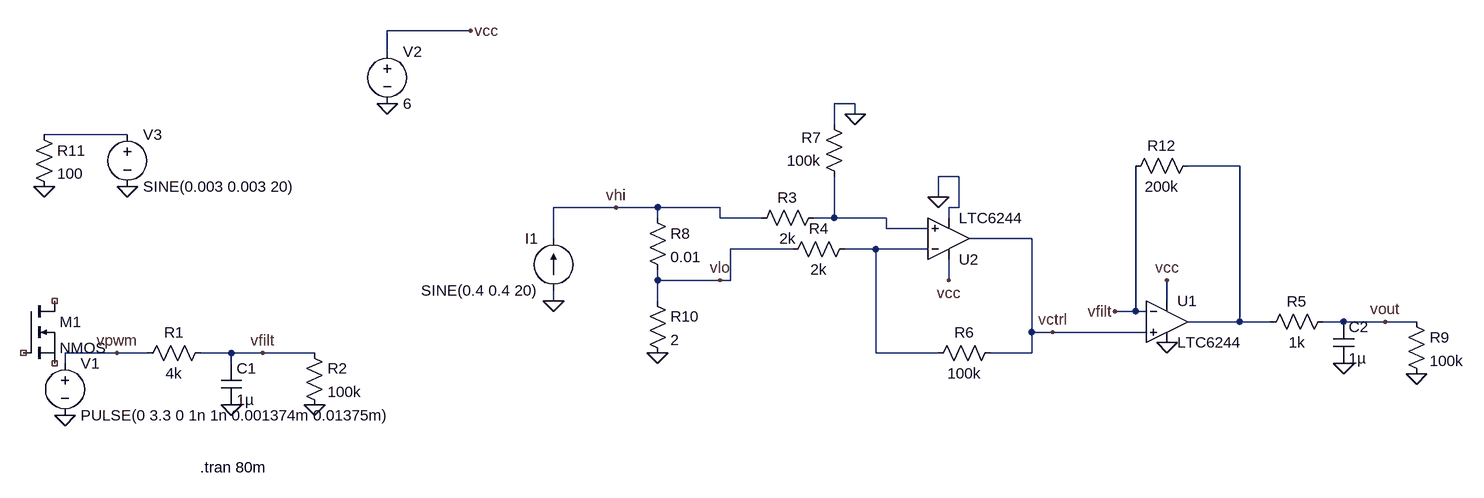
[diagram p0: schematic dchrg_ilim.asc]
dchrg_ilim.asc, the LTspice schematic file:
Version 4
SHEET 1 2260 680
WIRE 720 -368 592 -368
WIRE 592 -336 592 -368
WIRE 1312 -256 1280 -256
WIRE 1312 -240 1312 -256
WIRE 1280 -224 1280 -256
WIRE 192 -208 64 -208
WIRE 1904 -160 1824 -160
WIRE 1472 -144 1440 -144
WIRE 1440 -112 1440 -144
WIRE 944 -96 848 -96
WIRE 1008 -96 944 -96
WIRE 1104 -96 1008 -96
WIRE 1472 -96 1472 -144
WIRE 1472 -96 1456 -96
WIRE 1008 -80 1008 -96
WIRE 1104 -80 1104 -96
WIRE 1168 -80 1104 -80
WIRE 1280 -80 1280 -144
WIRE 1280 -80 1248 -80
WIRE 1360 -80 1280 -80
WIRE 1456 -80 1456 -96
WIRE 1360 -64 1360 -80
WIRE 1424 -64 1360 -64
WIRE 848 -48 848 -96
WIRE 1584 -48 1488 -48
WIRE 1216 -32 1120 -32
WIRE 1344 -32 1296 -32
WIRE 1424 -32 1344 -32
WIRE 1008 16 1008 0
WIRE 1104 16 1008 16
WIRE 1120 16 1120 -32
WIRE 1120 16 1104 16
WIRE 1456 16 1456 -16
WIRE 848 48 848 32
WIRE 1008 48 1008 16
WIRE 1792 48 1792 16
WIRE 1744 64 1744 -160
WIRE 1744 64 1712 64
WIRE 1760 64 1744 64
WIRE 1904 80 1904 -160
WIRE 1904 80 1824 80
WIRE 1952 80 1904 80
WIRE 2064 80 2032 80
WIRE 2128 80 2064 80
WIRE 2176 80 2128 80
WIRE 1584 96 1584 -48
WIRE 1616 96 1584 96
WIRE 1760 96 1616 96
WIRE 176 128 96 128
WIRE 224 128 176 128
WIRE 352 128 304 128
WIRE 400 128 352 128
WIRE 480 128 400 128
WIRE 1344 128 1344 -32
WIRE 1440 128 1344 128
WIRE 1584 128 1584 96
WIRE 1584 128 1520 128
WIRE 96 144 96 128
WIRE 352 144 352 128
FLAG 96 224 0
FLAG 352 208 0
FLAG 480 208 0
FLAG 176 128 vpwm
FLAG 400 128 vfilt
FLAG 592 -256 0
FLAG 720 -368 vcc
FLAG 1456 16 vcc
FLAG 1792 16 vcc
FLAG 1440 -112 0
FLAG 1792 112 0
FLAG 1712 64 vfilt
FLAG 1008 128 0
FLAG 848 48 0
FLAG 944 -96 vhi
FLAG 1616 96 vctrl
FLAG 2128 80 vout
FLAG 1312 -240 0
FLAG 2176 160 0
FLAG 2064 144 0
FLAG 192 -128 0
FLAG 64 -128 0
FLAG 1104 16 vlo
SYMBOL voltage 96 128 R0
WINDOW 123 0 0 Left 2
WINDOW 39 0 0 Left 2
SYMATTR InstName V1
SYMATTR Value PULSE(0 3.3 0 1n 1n 0.001374m 0.01375m)
SYMBOL res 320 112 R90
WINDOW 0 0 56 VBottom 2
WINDOW 3 32 56 VTop 2
SYMATTR InstName R1
SYMATTR Value 4k
SYMBOL cap 336 144 R0
SYMATTR InstName C1
SYMATTR Value 1µ
SYMBOL res 464 112 R0
SYMATTR InstName R2
SYMATTR Value 100k
SYMBOL Opamps\\LTC6244 1792 80 R0
SYMATTR InstName U1
SYMBOL Opamps\\LTC6244 1456 -48 M180
SYMATTR InstName U2
SYMBOL voltage 592 -352 R0
WINDOW 123 0 0 Left 2
WINDOW 39 0 0 Left 2
SYMATTR InstName V2
SYMATTR Value 6
SYMBOL res 1264 -96 R90
WINDOW 0 0 56 VBottom 2
WINDOW 3 32 56 VTop 2
SYMATTR InstName R3
SYMATTR Value 2k
SYMBOL res 1312 -48 R90
WINDOW 0 0 56 VBottom 2
WINDOW 3 32 56 VTop 2
SYMATTR InstName R4
SYMATTR Value 2k
SYMBOL res 2048 64 R90
WINDOW 0 0 56 VBottom 2
WINDOW 3 32 56 VTop 2
SYMATTR InstName R5
SYMATTR Value 1k
SYMBOL res 1536 112 R90
WINDOW 0 0 56 VBottom 2
WINDOW 3 32 56 VTop 2
SYMATTR InstName R6
SYMATTR Value 100k
SYMBOL res 1296 -128 R180
WINDOW 0 36 76 Left 2
WINDOW 3 36 40 Left 2
SYMATTR InstName R7
SYMATTR Value 100k
SYMBOL res 992 -96 R0
SYMATTR InstName R8
SYMATTR Value 0.01
SYMBOL voltage 192 -224 R0
WINDOW 123 0 0 Left 2
WINDOW 39 0 0 Left 2
SYMATTR InstName V3
SYMATTR Value SINE(0.003 0.003 20)
SYMBOL cap 2048 80 R0
SYMATTR InstName C2
SYMATTR Value 1µ
SYMBOL res 2160 64 R0
SYMATTR InstName R9
SYMATTR Value 100k
SYMBOL current 848 32 R180
WINDOW 0 24 80 Left 2
WINDOW 3 24 0 Left 2
WINDOW 123 0 0 Left 2
WINDOW 39 0 0 Left 2
SYMATTR InstName I1
SYMATTR Value SINE(0.4 0.4 20)
SYMBOL res 992 32 R0
SYMATTR InstName R10
SYMATTR Value 2
SYMBOL res 48 -224 R0
SYMATTR InstName R11
SYMATTR Value 100
SYMBOL res 1840 -176 R90
WINDOW 0 0 56 VBottom 2
WINDOW 3 32 56 VTop 2
SYMATTR InstName R12
SYMATTR Value 200k
SYMBOL nmos 32 48 R0
SYMATTR InstName M1
TEXT 304 304 Left 2 !.tran 80m

The netlist it stands for:
* dchrg_ilim.asc
V1 vpwm 0 PULSE(0 3.3 0 1n 1n 0.001374m 0.01375m)
R1 vfilt vpwm 4k
C1 vfilt 0 1µ
R2 vfilt 0 100k
XU1 vctrl vfilt vcc 0 N002 LTC6244  ; pins In+ In- V+ V- OUT
XU2 N003 N004 vcc 0 vctrl LTC6244  ; pins In+ In- V+ V- OUT
V2 vcc 0 6
R3 N003 vhi 2k
R4 N004 vlo 2k
R5 vout N002 1k
R6 vctrl N004 100k
R7 N003 0 100k
R8 vhi vlo 0.01
V3 N001 0 SINE(0.003 0.003 20)
C2 vout 0 1µ
R9 vout 0 100k
I1 0 vhi SINE(0.4 0.4 20)
R10 vlo 0 2
R11 N001 0 100
R12 N002 vfilt 200k
M1 NC_01 NC_02 NC_03 NC_03 NMOS
.model NMOS NMOS
.model PMOS PMOS
.lib standard.mos
.tran 80m
.backanno
.end